# EAGLE design TA_v2 (EAGLE 9.6.2)
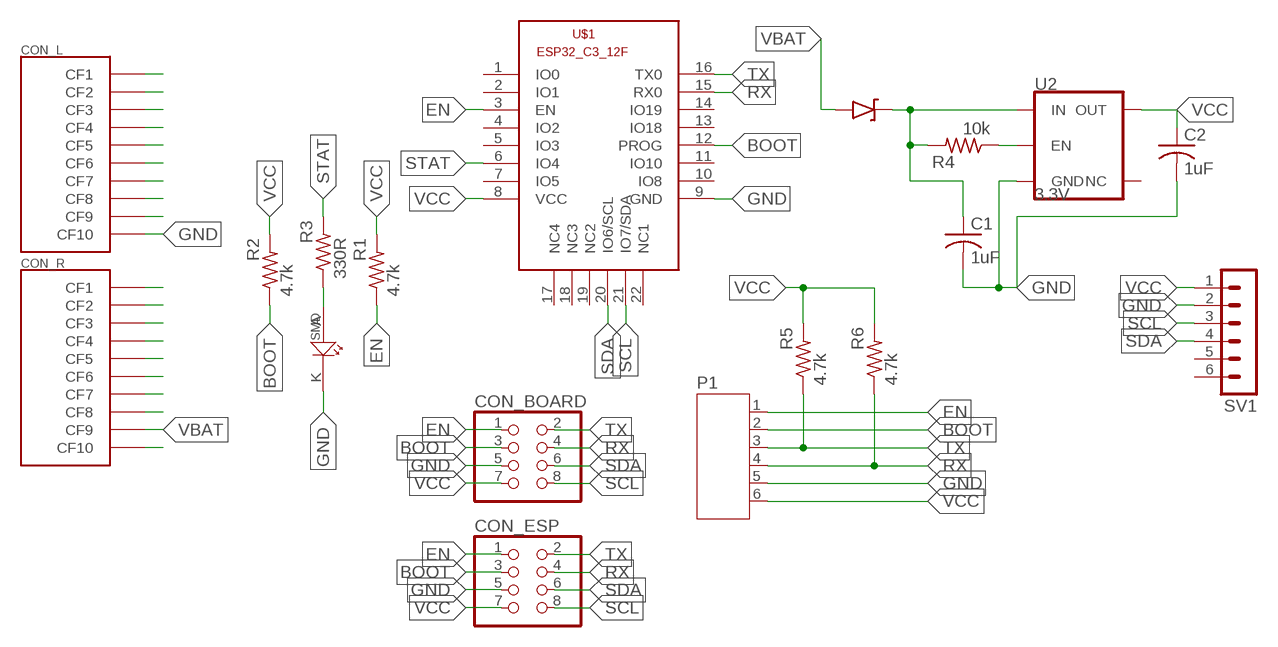
[diagram p0: schematic, sheet 1]

## Parts
C1  1uF  C-USC0805  [C0805]
C2  1uF  C-USC0805  [C0805]
CON_BOARD  PINHD-2X4  [2X04]
CON_ESP  PINHD-2X4  [2X04]
CON_L  FEMALE_CON  [FEMALE_HEADER_2]
CON_R  FEMALE_CON  [FEMALE_HEADER_2]
P1  JST-PH6  [JST-PH6]
R1  4.7k  R-US_R0603  [R0603]
R2  4.7k  R-US_R0603  [R0603]
R3  330R  R-US_R0603  [R0603]
R4  10k  R-US_R0603  [R0603]
R5  4.7k  R-US_R0603  [R0603]
R6  4.7k  R-US_R0603  [R0603]
SV1  MA06-1  [MA06-1]
U2  3.3V  V_REG_AP2112K-3.3V  [SOT23-5]
U$1  ESP32-C3-12FESP32-C3-12F  [ESP32-C3-12F]
U$2  1N5819  [SOT-323]
U$3  LED_SMD  [LED_0603]

## Nets
BOOT: CON_BOARD.3 CON_ESP.3 P1.2 R2.1 U$1.12(PROG)
EN: CON_BOARD.1 CON_ESP.1 P1.1 R1.1 U$1.3(EN)
GND: C1.2 C2.2 CON_BOARD.5 CON_ESP.5 CON_L.CF10 P1.5 SV1.2 U2.2(GND) U$1.9(GND) U$3.K
N$1: CON_R.CF10
N$2: C1.1 R4.2 U2.1(IN) U$2.K
N$3: CON_R.CF8
N$4: CON_R.CF7
N$5: CON_R.CF6
N$6: R4.1 U2.3(EN)
N$7: R3.1 U$3.A
N$8: CON_R.CF5
N$9: CON_R.CF4
N$10: CON_R.CF3
N$11: CON_R.CF2
N$12: CON_R.CF1
N$14: CON_L.CF9
N$15: CON_L.CF8
N$16: CON_L.CF7
N$17: CON_L.CF6
N$18: CON_L.CF5
N$19: CON_L.CF4
N$20: CON_L.CF3
N$21: CON_L.CF2
N$22: CON_L.CF1
RX: CON_BOARD.4 CON_ESP.4 P1.4 R6.1 U$1.15(RX0)
SCL: CON_BOARD.8 CON_ESP.8 SV1.3 U$1.21(IO7/SDA)
SDA: CON_BOARD.6 CON_ESP.6 SV1.4 U$1.20(IO6/SCL)
STAT: R3.2 U$1.6(IO4)
TX: CON_BOARD.2 CON_ESP.2 P1.3 R5.1 U$1.16(TX0)
VBAT: CON_R.CF9 U$2.A
VCC: C2.1 CON_BOARD.7 CON_ESP.7 P1.6 R1.2 R2.2 R5.2 R6.2 SV1.1 U2.5(OUT) U$1.8(VCC)
Unconnected: SV1.5 SV1.6 U2.4(NC) U$1.1(IO0) U$1.2(IO1) U$1.4(IO2) U$1.5(IO3) U$1.7(IO5) U$1.10(IO8) U$1.11(IO10) U$1.13(IO18) U$1.14(IO19) U$1.17(NC4) U$1.18(NC3) U$1.19(NC2) U$1.22(NC1)

## Library data of the parts
C1 C2 = rcl:C-US: CAPACITOR, American symbol; SPICEPREFIX: C
CON_BOARD CON_ESP = pinhead:PINHD-2X4: PIN HEADER
CON_L CON_R = crazyflie_lib:FEMALE_CON
P1 = jst-ph:JST-PH6
R1-R6 = rcl:R-US_: RESISTOR, American symbol; SPICEPREFIX: R
SV1 = con-lstb:MA06-1: PIN HEADER; OC_FARNELL: unknown; OC_NEWARK: unknown
U2 = AP2112:V_REG_AP2112: AP2112 - 600mA CMOS LDO Regulator w/ Enable The AP2112 is CMOS process low dropout linear regulator with enable function, the regulator delivers a guaranteed 600mA (min.) continuous load current. Features Output Voltage Accuracy: ±1.5% Output Current: 600mA (Min.) Foldback Short Current Protection: 50mA Enable Function to Turn ON/OFF VOUT Low Dropout Voltage (3.3V): 250mV (Typ.) @IOUT=600mA Excellent Load Regulation: 0.2%/A (Typ.) Excellent Line Regulation: 0.02%/V (Typ.) Low Quiescent Current: 55μA (Typ.) Low Standby Current: 0.01μA (Typ.) Low Output Noise: 50μVRMS PSRR: 100Hz -65dB, 1kHz -65dB OTSD Protection Stable with 1.0μF Flexible Cap: Ceramic, Tantalum and Aluminum Electrolytic Operation Temperature Range: -40°C to 85°C ESD: MM 400V, HBM 4000V; PROD_ID: VREG-12457
U$1 = ESP32-C3-12F:ESP32-C3-12F: ESP32-C3-12F Created by Egar Pambudi
U$2 = Diodes:1N5819
U$3 = LED_SMD:LED_SMD

## Board
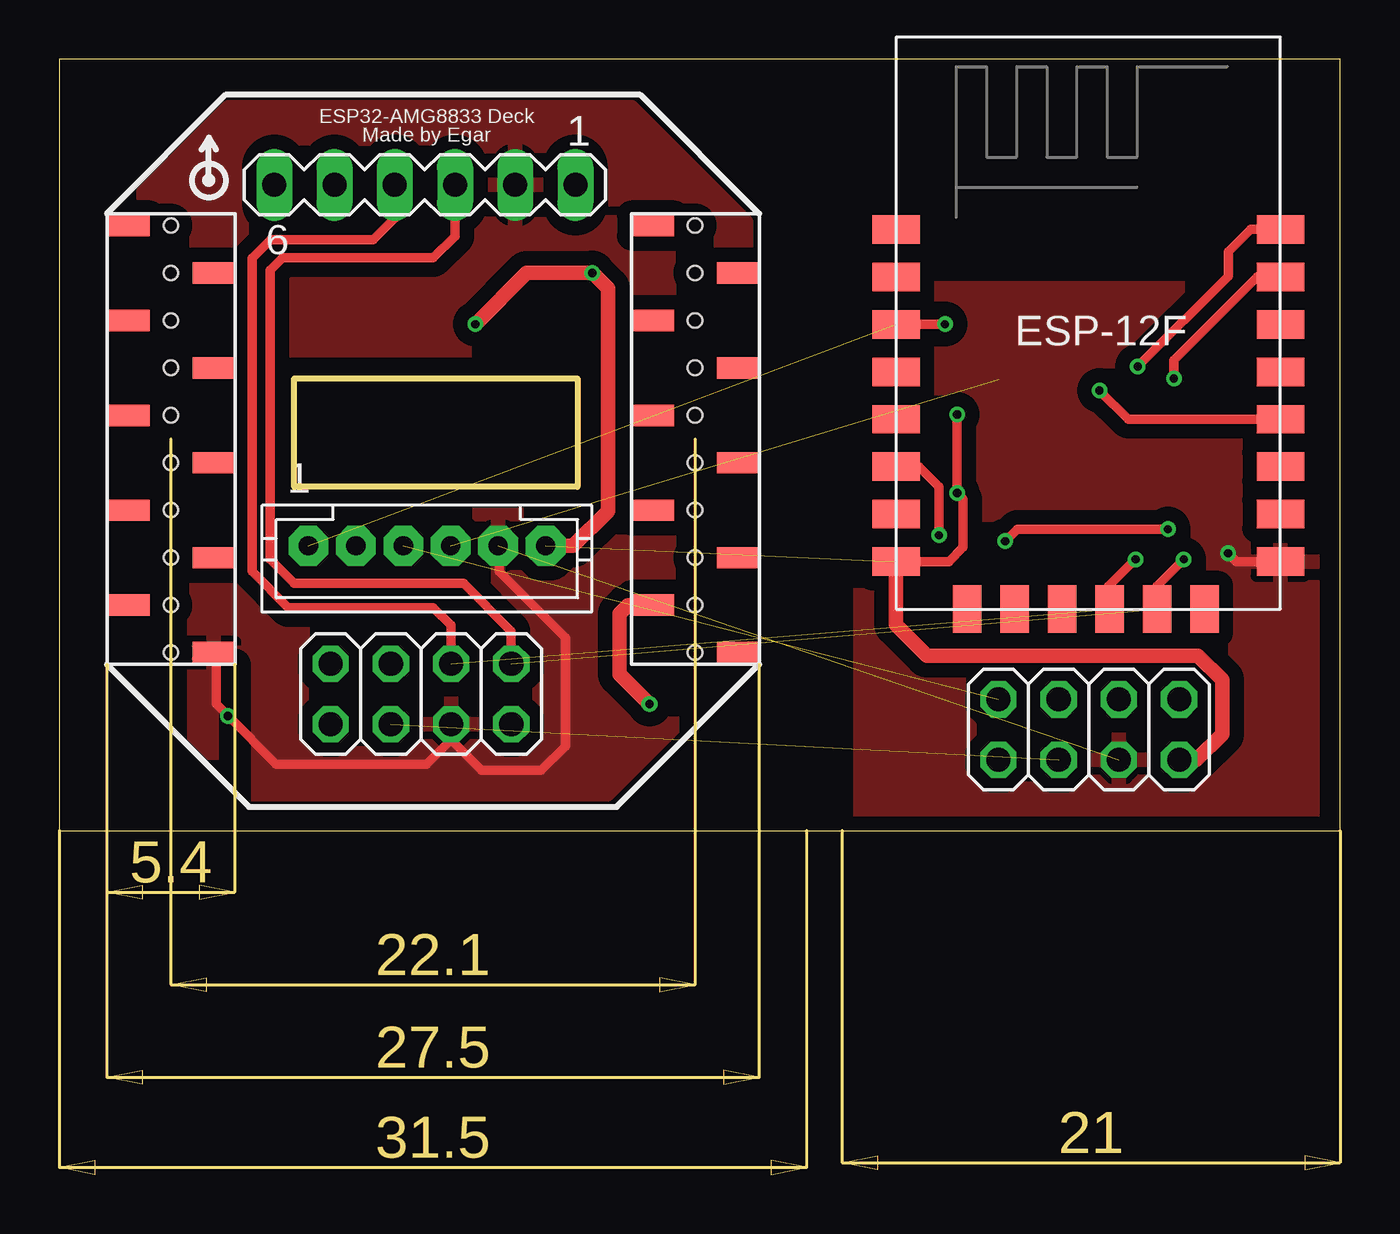
[diagram p1: board, top side]
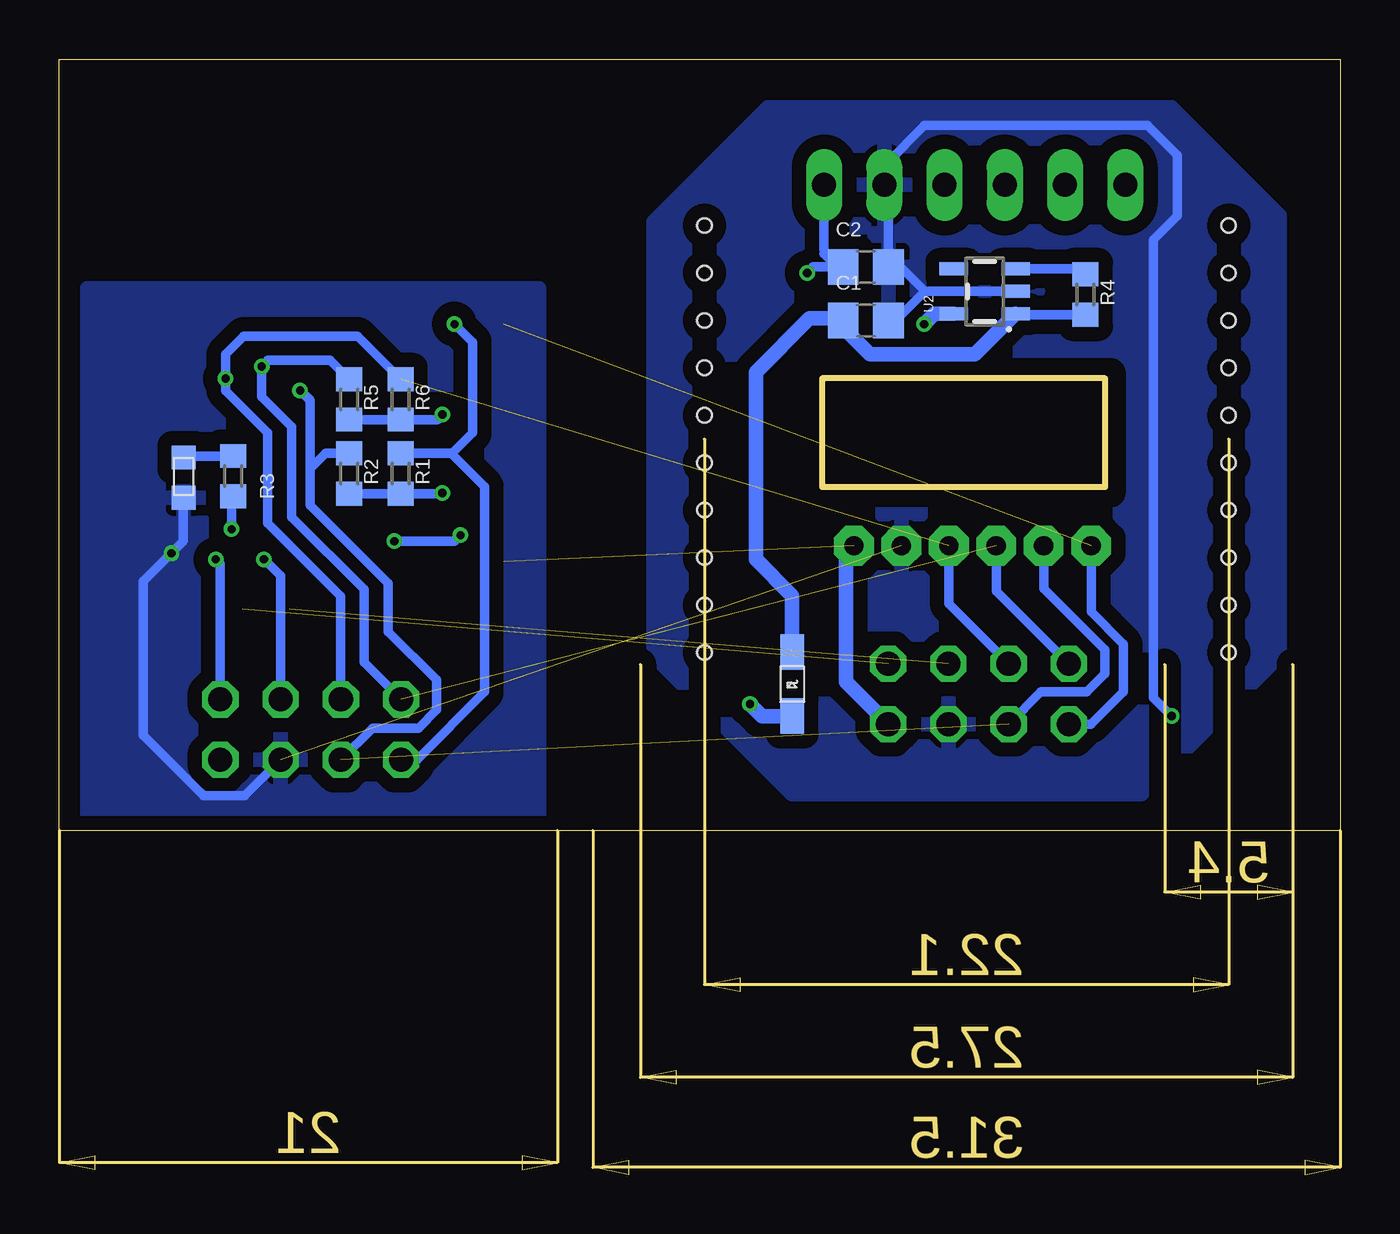
[diagram p2: board, bottom side, seen from below]

Size 54 x 32.5 mm. Coordinates in mm from the lower left corner, seen from the top.
Outline: 0,0 54,0 54,32.5 0,32.5 0,0
Copper layers (1*16): Top 0.035mm / dielectric 1.6mm / Bottom 0.035mm
Design rules "Elecrow_2-layer_PCB_eagle_rule": minimum track width 6mil, minimum drill 12mil, track to track 6mil, track to pad 6mil, pad to pad 6mil, via to via 8mil, smd to smd 0mil, copper to edge 20mil, drill to drill 10mil, minimum pad ring 6mil, minimum via ring 6mil, stop-mask expansion 0mil, vias tented up to drill 100mil, thermal gap 10mil
tKeepout: area 31.5,0 to 33,32.5
tRestrict: area 9.7,14.2 to 22.1,19.3
bRestrict: area 9.7,14.2 to 22.1,19.3
Milling: area 9.9,14.5 to 21.8,19.1

### Footprints (pad centres in the part's own frame; a part is rotated, then mirrored left to right if it is on the bottom)
C0805 = smd 1.3 x 1.5: 1 -0.95,0; 2 0.95,0
2X04 = drill 1.016 octagon: 1 -3.81,-1.27; 2 -3.81,1.27; 3 -1.27,-1.27; 4 -1.27,1.27; 5 1.27,-1.27; 6 1.27,1.27; 7 3.81,-1.27; 8 3.81,1.27
FEMALE_HEADER_2 = smd 0.9 x 1.8: CF1 -8.996,-1.782; CF2 -6.996,1.818; CF3 -4.996,-1.782; CF4 -2.996,1.818; CF5 -0.996,-1.782; CF6 1.004,1.818; CF7 3.004,-1.782; CF8 5.004,1.818; CF9 7.004,-1.782; CF10 9.004,1.818 | hole 0.6: 1,0; -1,0; -3,0; -5,0; -7,0; -9,0; 3,0; 5,0; 7,0; 9,0
JST-PH6 = drill 0.813 pad 1.676 octagon: 1 5,0; 2 3,0; 3 1,0; 4 -1,0; 5 -3,0; 6 -5,0
R0603 = smd 1 x 1.1: 1 -0.85,0; 2 0.85,0
MA06-1 = drill 1.016 long: 1 -6.35,0; 2 -3.81,0; 3 -1.27,0; 4 1.27,0; 5 3.81,0; 6 6.35,0
SOT23-5 = smd 0.55 x 1.2: 1 -0.95,-1.3; 2 0,-1.3; 3 0.95,-1.3; 4 0.95,1.3; 5 -0.95,1.3
ESP32-C3-12F = smd 2 x 1.2: 1 -7.62,5.84; 2 -7.62,3.84; 3 -7.62,1.84; 4 -7.62,-0.16; 5 -7.62,-2.16; 6 -7.62,-4.16; 7 -7.62,-6.16; 8 -7.62,-8.16; 9 8.58,-8.16; 10 8.58,-6.16; 11 8.58,-4.16; 12 8.58,-2.16; 13 8.58,-0.16; 14 8.58,1.84; 15 8.58,3.84; 16 8.58,5.84 | smd 1.2 x 2: 17 -4.62,-10.16; 18 -2.62,-10.16; 19 -0.62,-10.16; 20 1.38,-10.16; 21 3.38,-10.16; 22 5.38,-10.16
SOT-323 = smd 1.5 x 1: A 1.3,0; K -1.4,0
LED_0603 = smd 1 x 1: A -0.8,0; K 0.9,0

### Placement (x,y rotation side)
C1  20,21.5 0 bottom
C2  20,23.75 0 bottom
CON_BOARD  15.25,5.75 0 top
CON_ESP  43.4,4.25 0 top
CON_L  4.7,16.5 270 top
CON_R  26.8,16.5 270 top
P1  15.5,12 180 top
R1  39.62,15.04 270 bottom
R2  41.78,15.04 270 bottom
R3  46.67,14.93 270 bottom
R4  10.74,22.59 270 bottom
R5  41.78,18.17 270 bottom
R6  39.62,18.17 270 bottom
SV1  15.41,27.21 180 top
U2  14.99,22.72 90 bottom
U$1  42.9,19.49 0 top
U$2  23.1,6.12 270 bottom
U$3  48.76,14.92 270 bottom

### Tracks (layer width: path | path; a pad name or v marks a point on that pad's centre or on a via)
BOOT  (via drill 0.35)  (1 unrouted)
  Top 0.406: v43.85,18.54 45.06,17.33 U$1.12
  Bottom 0.406: CON_BOARD.3 12.62,5.84 10.68,5.84 9.92,6.6 9.92,7.62 12.5,10.2 P1.2 | CON_ESP.3 40.8,4.32 38.86,4.32 38.1,5.08 38.1,6.35 40.13,8.38 40.13,10.41 43.43,13.72 43.43,15.24 | R2.1 42.78,15.89 43.43,15.24 | 43.43,15.24 43.43,18.13 v43.85,18.54
EN  (via drill 0.35)  (1 unrouted)
  Top 0.406: v37.34,21.34 v37.33,21.33 U$1.3
  Bottom 0.406: P1.1 10.5,9.21 9.14,7.86 9.14,5.84 10.5,4.48 CON_BOARD.1 | R1.1 37.48,15.89 | 37.48,15.89 37.45,15.89 36.58,16.76 36.58,20.57 v37.34,21.34 | 37.48,15.89 36.07,14.48 36.07,5.84 38.93,2.98 CON_ESP.1
GND  (via drill 0.35)  (1 unrouted)
  Top 0.406: CON_L.CF10 6.6,7.5 6.6,5.33 v7.11,4.83 9.14,2.79 15.49,2.79 16.52,3.82 | 16.52,3.82 CON_BOARD.5 | P1.5 18.54,11.96 18.54,10.92 21.34,8.13 21.34,3.56 20.32,2.54 17.79,2.54 16.52,3.82 | v49.28,11.68 49.63,11.33 U$1.9
  Bottom 0.406: U2.2 17.51,22.72 | 17.51,22.72 18.54,23.75 C2.2 19.05,27.04 19.12,27.11 | C1.2 18.73,21.5 17.51,22.72 | 19.12,27.11 SV1.2 | CON_ESP.5 46.18,1.47 47.91,1.47 50.45,4.01 50.45,10.51 v49.28,11.68 48.77,12.19 U$3.K | v7.11,4.83 7.87,5.59 7.87,24.89 6.86,25.91 6.86,28.45 8.13,29.72 17.53,29.72 19.12,28.12 19.12,27.11
  pour Bottom (isolate 0.61): 2.54,25.91 7.11,30.48 24.13,30.48 28.96,25.65 28.96,7.37 23.11,1.52 8.38,1.52 2.54,7.37
  pour Top (isolate 0.61): 2.54,25.91 7.11,30.48 24.13,30.48 28.96,25.65 28.96,7.37 23.11,1.52 8.13,1.52 2.54,7.11
  pour Top (isolate 0.61): 33.78,22.86 52.83,22.86 52.83,0.51 33.78,0.51
  pour Bottom (isolate 0.61, rank 4): 33.78,22.86 52.83,22.86 52.83,0.51 33.78,0.51
N$2
  Bottom 0.254: 13.66,21.74 U2.1
  Bottom 0.406: R4.2 13.66,21.74 | 21.04,21.59 C1.1 20.95,21.19
  Bottom 0.61: 21.04,21.59 22.37,21.59 24.64,19.32 24.64,11.43 23.11,9.9 U$2.K | U2.1 15.39,20.07 19.83,20.07 20.95,21.19
N$6
  Bottom 0.406: R4.1 10.97,23.67 U2.3
N$7
  Bottom 0.406: R3.1 48.7,15.78 U$3.A
RX  (via drill 0.35)  (1 unrouted)
  Top 0.406: v46.99,19.05 46.99,19.81 50.51,23.33 U$1.15
  Bottom 0.406: P1.4 16.5,9.55 CON_BOARD.4 | CON_ESP.4 42.13,9.87 45.21,12.95 45.21,16.76 46.99,18.54 v46.99,19.05 46.99,20.07 46.23,20.83 41.43,20.83 R6.1
SCL  (via drill 0.35)  (1 unrouted)
  Top 0.254: U$1.21 46.28,10.05
  Top 0.406: CON_BOARD.8 19.06,8.39 17.03,10.41 9.91,10.41 8.89,11.43 8.89,23.61 9.41,24.13 15.76,24.13 16.68,25.05 SV1.3 | v47.41,11.43 46.28,10.3 U$1.21
  Bottom 0.406: CON_ESP.8 47.21,11.23 v47.41,11.43
SDA  (via drill 0.35)  (1 unrouted)
  Top 0.254: 44.23,9.28 U$1.20
  Top 0.406: CON_BOARD.6 16.52,8.65 15.76,9.4 9.65,9.4 8.13,10.92 8.13,24.11 8.91,24.89 13.22,24.89 14.14,25.81 SV1.4 | v45.37,11.43 44.23,10.29 44.23,9.28
  Bottom 0.406: CON_ESP.6 44.67,10.73 v45.37,11.43
STAT  (via drill 0.35)
  Top 0.406: v46.74,12.7 40.39,12.7 v39.88,12.19 | v37.08,12.45 37.08,14.48 36.23,15.33 U$1.6
  Bottom 0.406: R3.2 46.74,14.02 v46.74,12.7 | v39.88,12.19 37.34,12.19 v37.08,12.45
TX  (via drill 0.35)  (1 unrouted)
  Top 0.406: v45.47,19.56 49.28,23.37 49.28,24.38 50.22,25.33 U$1.16
  Bottom 0.406: P1.3 14.5,10.09 CON_BOARD.2 | CON_ESP.2 41.15,7.08 41.15,10.16 44.2,13.21 44.2,17.02 45.47,18.29 v45.47,19.56 45.21,19.81 42.58,19.81 R5.1
VBAT  (via drill 0.35)
  Top 0.61: v24.88,5.33 23.62,6.59 23.62,9.14 23.97,9.5 CON_R.CF9
  Bottom 0.61: v24.88,5.33 24.38,4.82 U$2.A
VCC  (via drill 0.35)  (1 unrouted)
  Top 0.406: v22.47,23.5 22.49,23.5 | v37.85,17.53 v37.85,14.22 38.1,13.97 38.1,11.94 37.49,11.33 U$1.8
  Top 0.61: 22.49,23.5 23.13,22.86 23.13,13.46 21.67,12 P1.6 | v17.54,21.34 19.71,23.5 v22.47,23.5 | CON_ESP.7 47.94,2.98 49.02,4.06 49.02,6.35 48.01,7.37 36.58,7.37 35.28,8.66 U$1.8
  Bottom 0.152: 21.76,24.47 21.76,24.31 | 20.96,23.51 C2.1
  Bottom 0.406: SV1.1 21.76,24.47 | 21.76,24.31 20.96,23.51 | v22.47,23.5 22.22,23.75 C2.1 | v37.85,14.22 37.88,14.19 R1.2 R2.2 | v37.85,17.53 38.06,17.32 R6.2 R5.2
  Bottom 0.61: CON_BOARD.7 20.84,6.27 20.84,11.66 P1.6 | U2.5 17.11,21.77 v17.54,21.34

### Text on the board
tNames: ESP32-AMG8833 Deck / Made by Egar
tValues: AMG8833-CONN | PROG | ESP32 / Breakout / Board | ESP32-CONN
bValues: LED